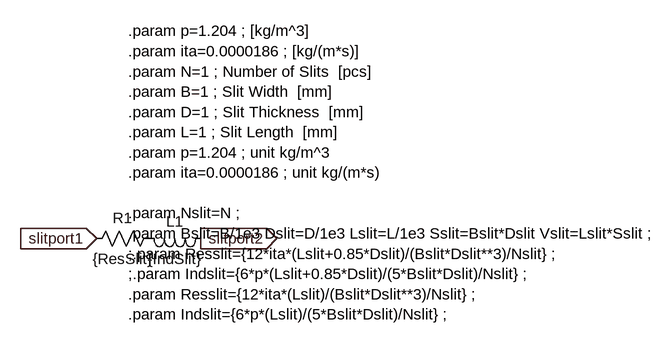
[diagram p0: schematic SlitModel.asc]
SlitModel.asc, the LTspice schematic file:
Version 4
SHEET 1 1216 680
FLAG 160 432 slitport1
IOPIN 160 432 In
FLAG 320 432 slitport2
IOPIN 320 432 Out
SYMBOL res 256 416 R90
WINDOW 0 0 56 VBottom 2
WINDOW 3 32 56 VTop 2
SYMATTR InstName R1
SYMATTR Value {ResSlit}
SYMBOL ind 336 416 R90
WINDOW 0 5 56 VBottom 2
WINDOW 3 32 56 VTop 2
SYMATTR InstName L1
SYMATTR Value {IndSlit}
TEXT 208 112 Left 2 !.param p=1.204 ; [kg/m^3]\n.param ita=0.0000186 ; [kg/(m*s)]\n.param N=1 ; Number of Slits  [pcs]\n.param B=1 ; Slit Width  [mm]\n.param D=1 ; Slit Thickness  [mm]\n.param L=1 ; Slit Length  [mm]\n.param p=1.204 ; unit kg/m^3\n.param ita=0.0000186 ; unit kg/(m*s)\n \n.param Nslit=N ;\n.param Bslit=B/1e3 Dslit=D/1e3 Lslit=L/1e3 Sslit=Bslit*Dslit Vslit=Lslit*Sslit ;\n;.param Resslit={12*ita*(Lslit+0.85*Dslit)/(Bslit*Dslit**3)/Nslit} ;\n;.param Indslit={6*p*(Lslit+0.85*Dslit)/(5*Bslit*Dslit)/Nslit} ;\n.param Resslit={12*ita*(Lslit)/(Bslit*Dslit**3)/Nslit} ;\n.param Indslit={6*p*(Lslit)/(5*Bslit*Dslit)/Nslit} ;

The netlist it stands for:
* SlitModel.asc
R1 P001 slitport1 {ResSlit}
L1 slitport2 P001 {IndSlit}
.param p=1.204 ; [kg/m^3]
.param ita=0.0000186 ; [kg/(m*s)]
.param N=1 ; Number of Slits  [pcs]
.param B=1 ; Slit Width  [mm]
.param D=1 ; Slit Thickness  [mm]
.param L=1 ; Slit Length  [mm]
.param p=1.204 ; unit kg/m^3
.param ita=0.0000186 ; unit kg/(m*s)
.param Nslit=N ;
.param Bslit=B/1e3 Dslit=D/1e3 Lslit=L/1e3 Sslit=Bslit*Dslit Vslit=Lslit*Sslit ;
;.param Resslit={12*ita*(Lslit+0.85*Dslit)/(Bslit*Dslit**3)/Nslit} ;
;.param Indslit={6*p*(Lslit+0.85*Dslit)/(5*Bslit*Dslit)/Nslit} ;
.param Resslit={12*ita*(Lslit)/(Bslit*Dslit**3)/Nslit} ;
.param Indslit={6*p*(Lslit)/(5*Bslit*Dslit)/Nslit} ;
.backanno
.end